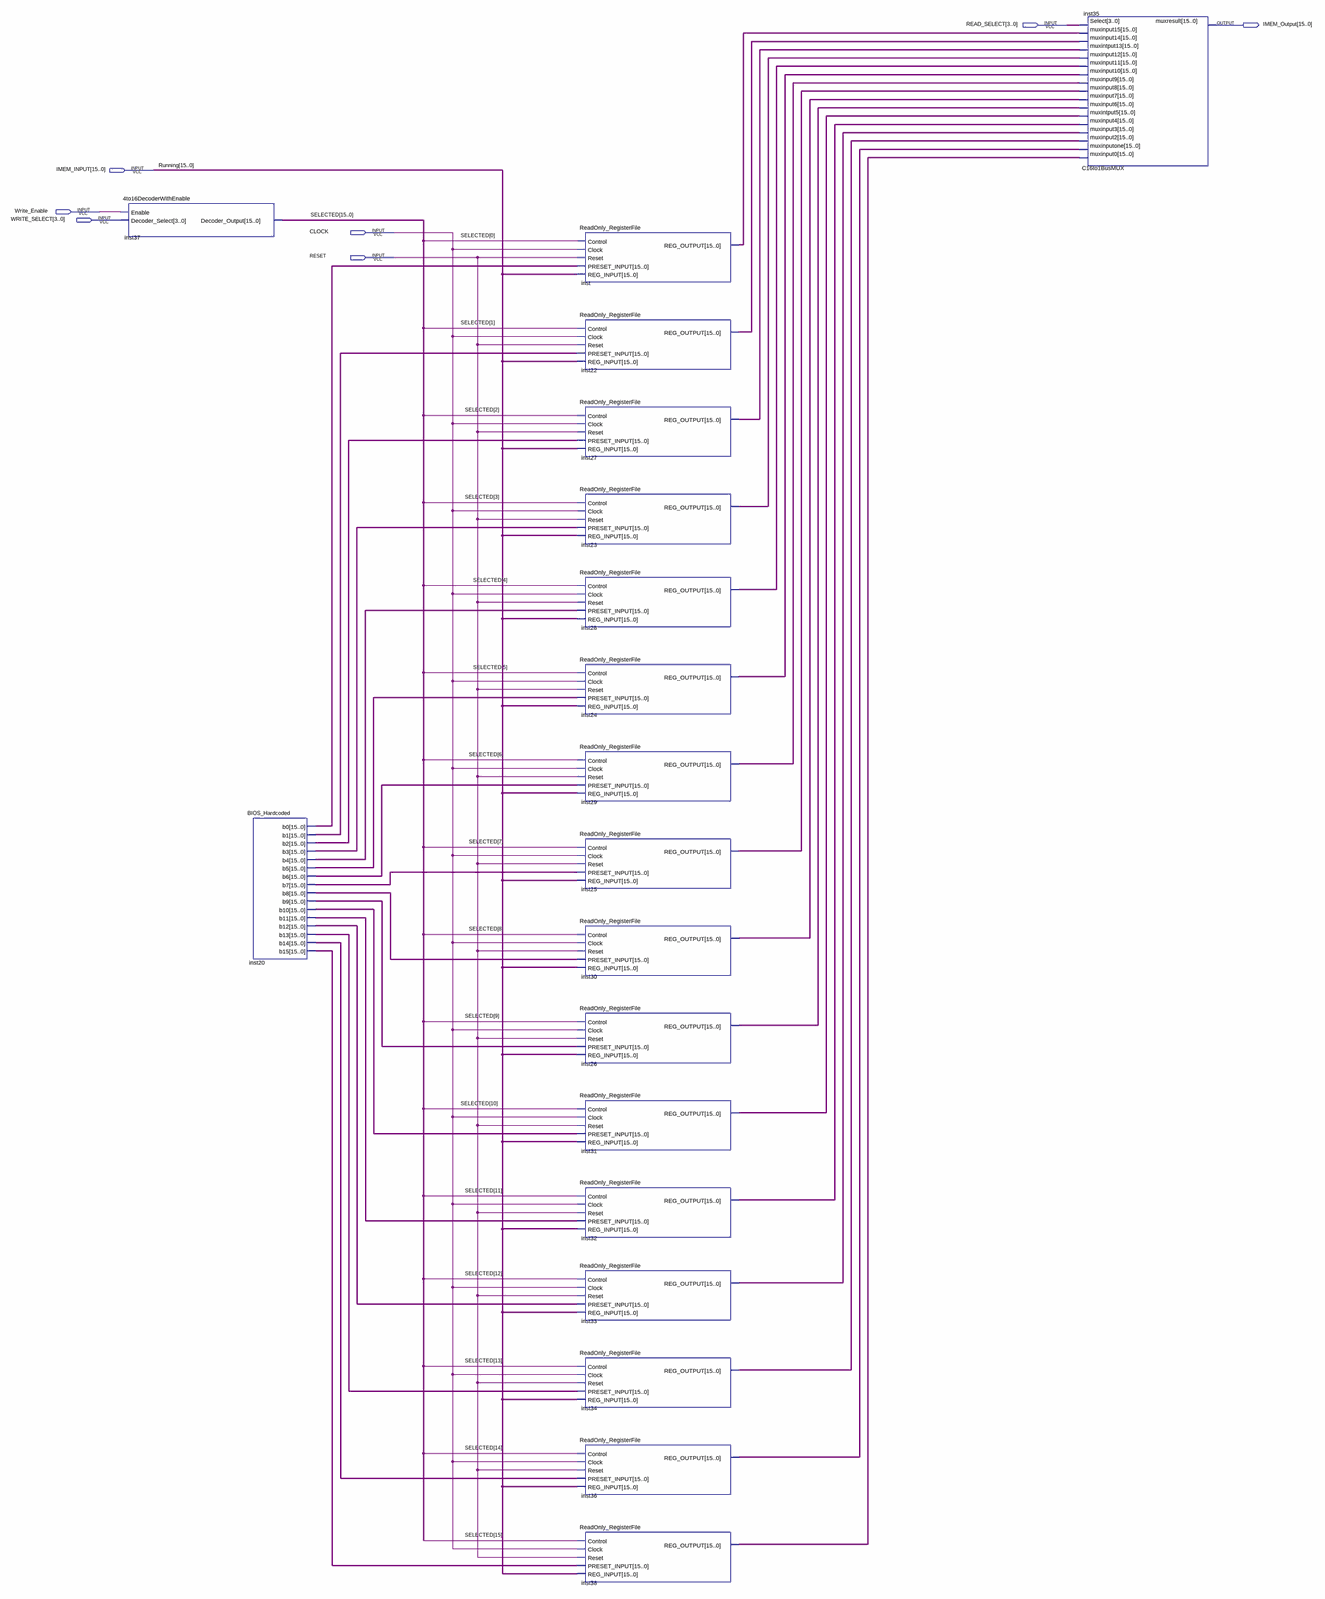
[diagram p0: schematic sheet, whole]
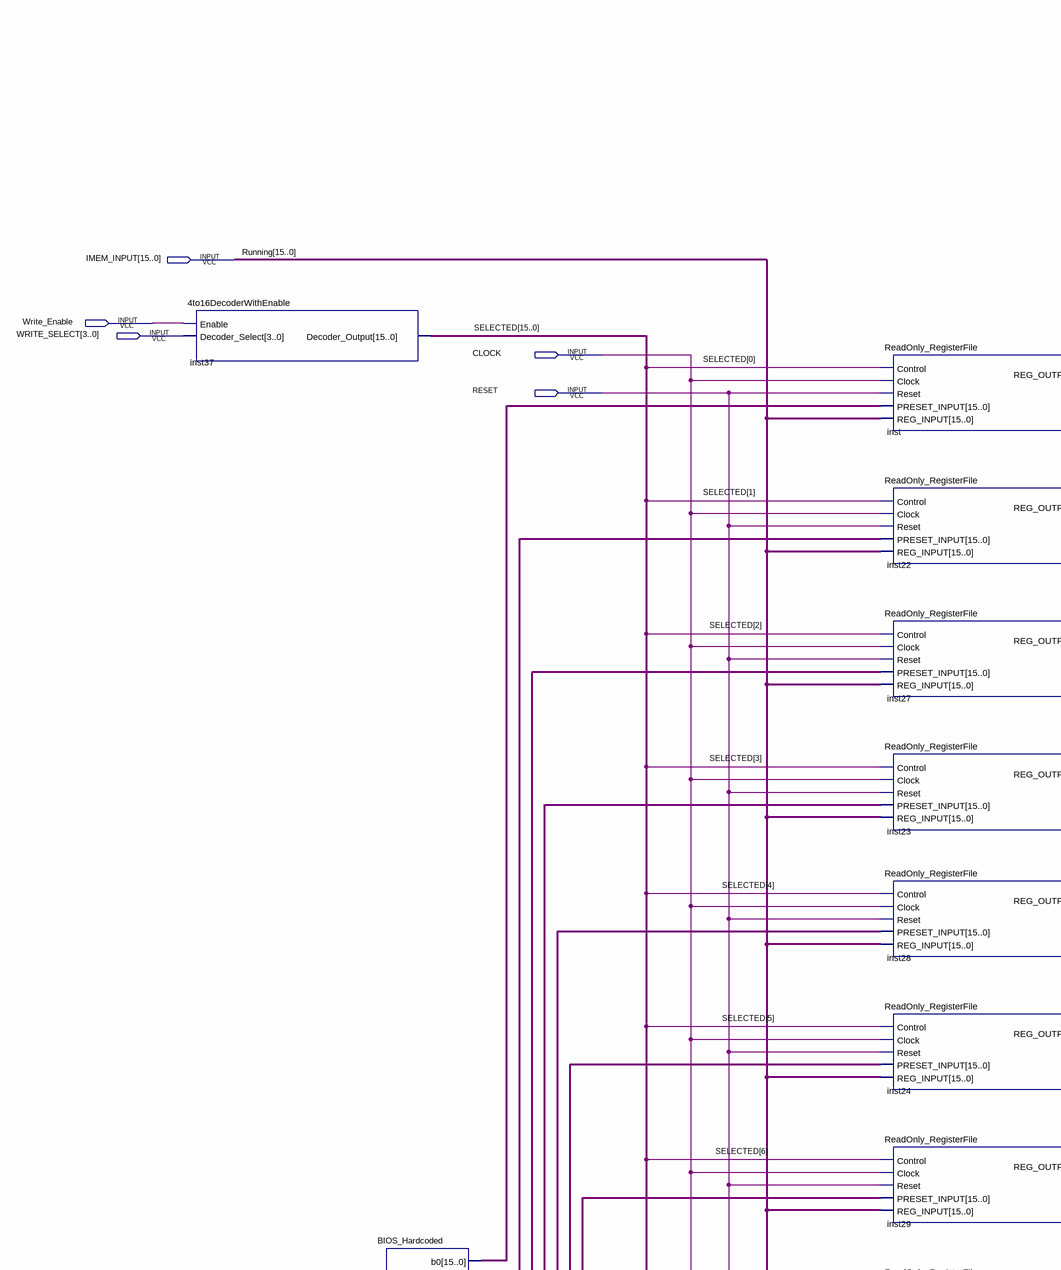
[diagram p1: schematic sheet, upper left part]
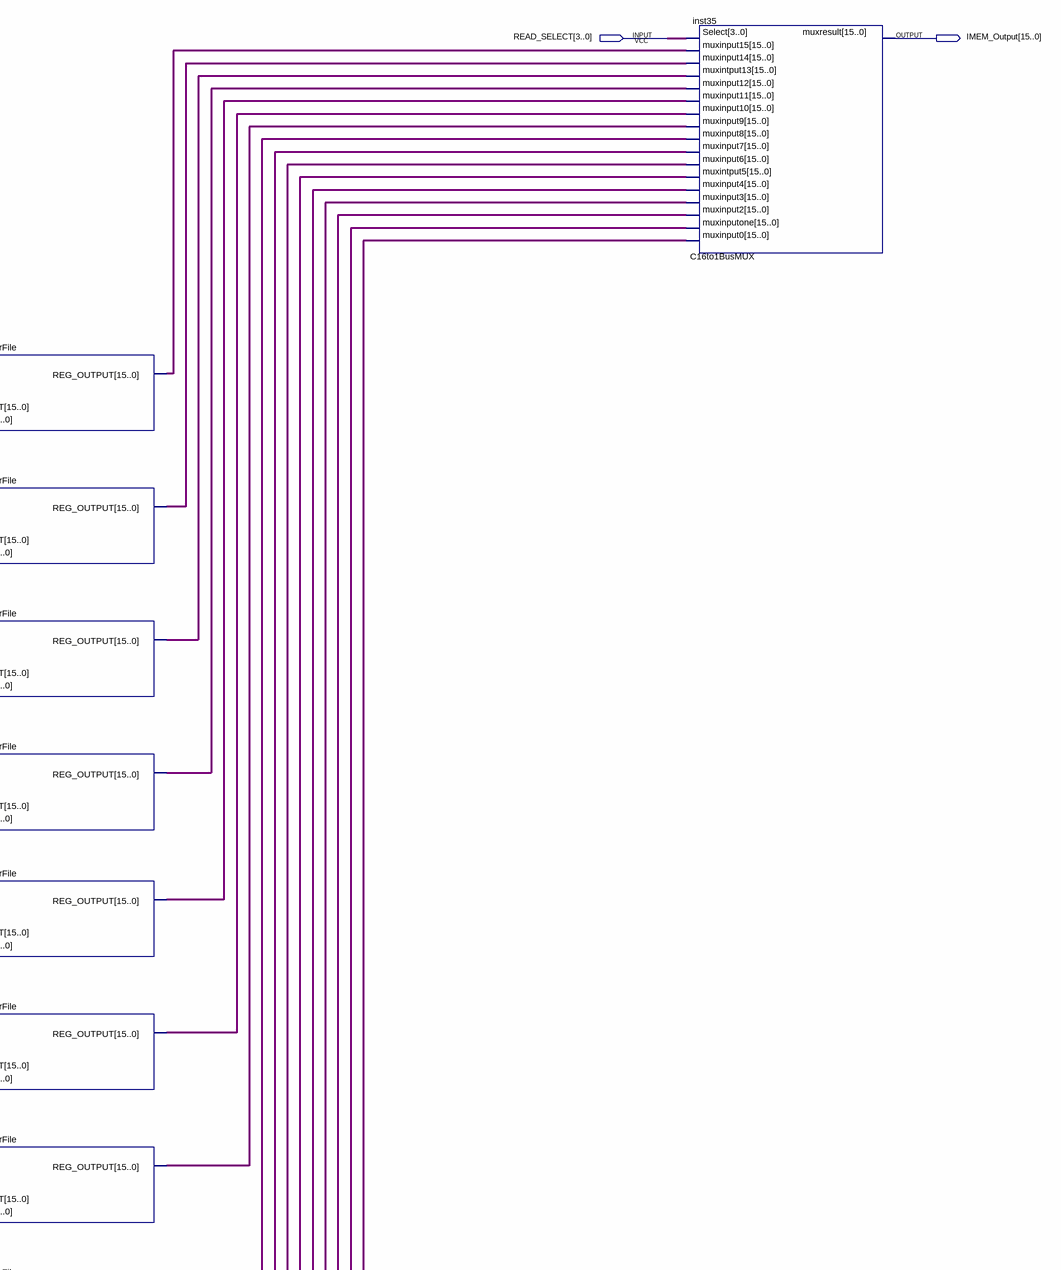
[diagram p2: schematic sheet, upper right part]
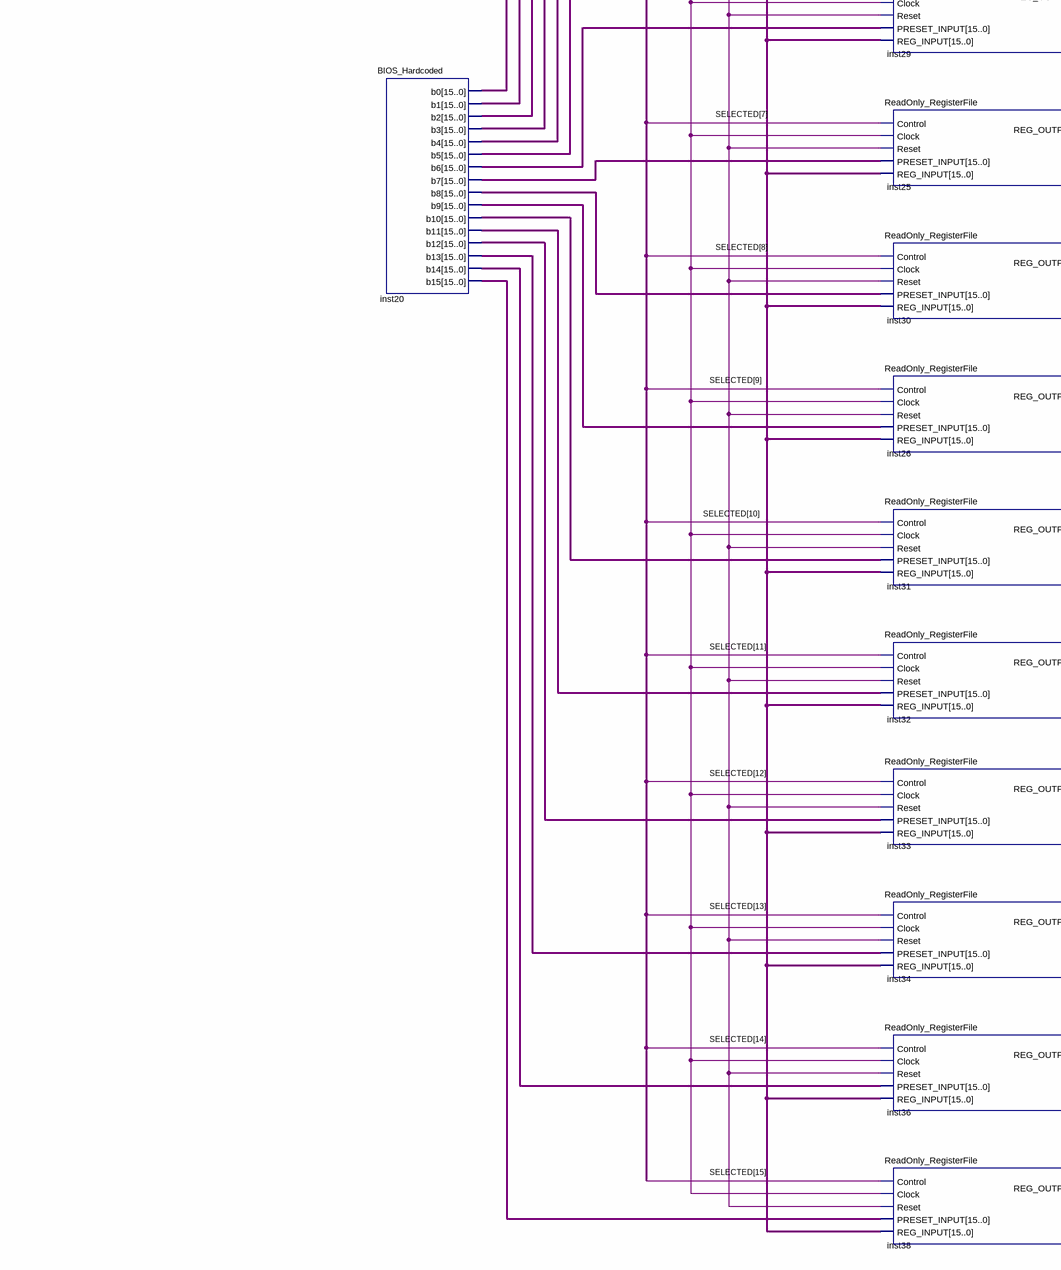
[diagram p3: schematic sheet, lower left part]
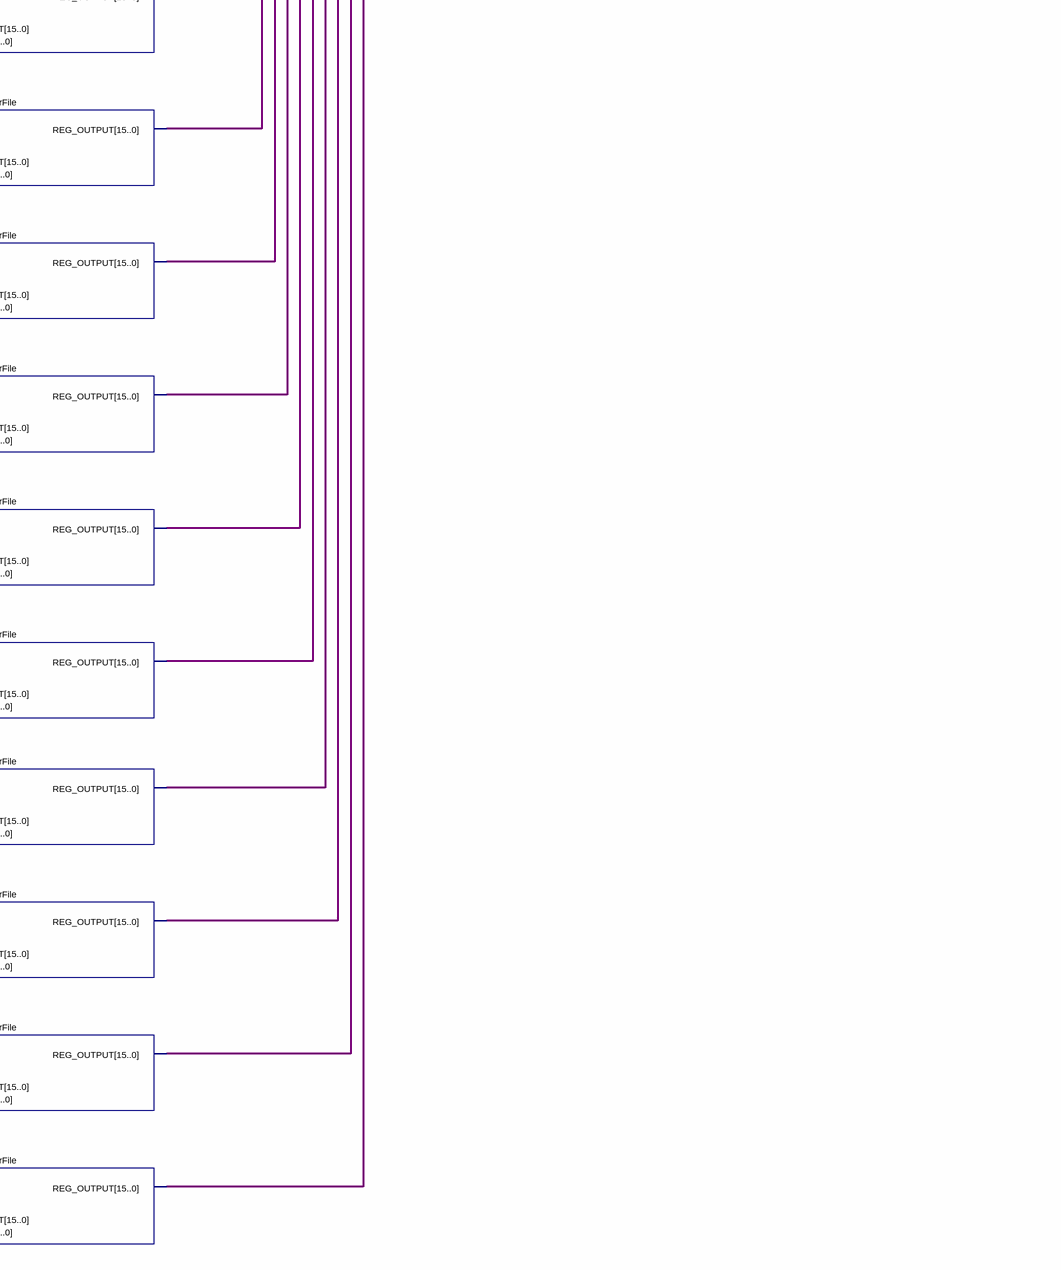
[diagram p4: schematic sheet, lower right part]
// Quartus schematic ReadOnly_16x16_Register_File.bdf as structural Verilog: 19 symbols, 7 pins
module ReadOnly_16x16_Register_File (
  input  [3:0] READ_SELECT,
  input  [15:0] IMEM_INPUT,
  input  Write_Enable,
  input  [3:0] WRITE_SELECT,
  input  CLOCK,
  input  RESET,
  output [15:0] IMEM_Output
);

  wire [15:0] inst20_b0, inst20_b1, inst20_b2, inst20_b3, inst20_b4, inst20_b5, inst20_b6, inst20_b7,
       inst20_b8, inst20_b9, inst20_b10, inst20_b11, inst20_b12, inst20_b13, inst20_b14, inst20_b15,
       inst22_reg_output, inst23_reg_output, inst24_reg_output, inst25_reg_output, inst26_reg_output,
       inst27_reg_output, inst28_reg_output, inst29_reg_output, inst30_reg_output, inst31_reg_output,
       inst32_reg_output, inst33_reg_output, inst34_reg_output, inst36_reg_output, inst38_reg_output,
       inst_reg_output, SELECTED;

  \4to16DecoderWithEnable  inst37 (.Enable(Write_Enable), .Decoder_Select(WRITE_SELECT), .Decoder_Output(SELECTED));
  BIOS_Hardcoded inst20 (
    .b0(inst20_b0), .b1(inst20_b1), .b2(inst20_b2), .b3(inst20_b3), .b4(inst20_b4), .b5(inst20_b5),
    .b6(inst20_b6), .b7(inst20_b7), .b8(inst20_b8), .b9(inst20_b9), .b10(inst20_b10), .b11(inst20_b11),
    .b12(inst20_b12), .b13(inst20_b13), .b14(inst20_b14), .b15(inst20_b15));
  ReadOnly_RegisterFile inst (
    .PRESET_INPUT(inst20_b0), .Control(SELECTED[0]), .Clock(CLOCK), .Reset(RESET), .REG_INPUT(IMEM_INPUT),
    .REG_OUTPUT(inst_reg_output));
  ReadOnly_RegisterFile inst22 (
    .PRESET_INPUT(inst20_b1), .Control(SELECTED[1]), .Clock(CLOCK), .Reset(RESET), .REG_INPUT(IMEM_INPUT),
    .REG_OUTPUT(inst22_reg_output));
  ReadOnly_RegisterFile inst27 (
    .PRESET_INPUT(inst20_b2), .Control(SELECTED[2]), .Clock(CLOCK), .Reset(RESET), .REG_INPUT(IMEM_INPUT),
    .REG_OUTPUT(inst27_reg_output));
  ReadOnly_RegisterFile inst23 (
    .PRESET_INPUT(inst20_b3), .Control(SELECTED[3]), .Clock(CLOCK), .Reset(RESET), .REG_INPUT(IMEM_INPUT),
    .REG_OUTPUT(inst23_reg_output));
  ReadOnly_RegisterFile inst28 (
    .PRESET_INPUT(inst20_b4), .Control(SELECTED[4]), .Clock(CLOCK), .Reset(RESET), .REG_INPUT(IMEM_INPUT),
    .REG_OUTPUT(inst28_reg_output));
  ReadOnly_RegisterFile inst24 (
    .PRESET_INPUT(inst20_b5), .Control(SELECTED[5]), .Clock(CLOCK), .Reset(RESET), .REG_INPUT(IMEM_INPUT),
    .REG_OUTPUT(inst24_reg_output));
  ReadOnly_RegisterFile inst29 (
    .PRESET_INPUT(inst20_b6), .Control(SELECTED[6]), .Clock(CLOCK), .Reset(RESET), .REG_INPUT(IMEM_INPUT),
    .REG_OUTPUT(inst29_reg_output));
  ReadOnly_RegisterFile inst25 (
    .PRESET_INPUT(inst20_b7), .Control(SELECTED[7]), .Clock(CLOCK), .Reset(RESET), .REG_INPUT(IMEM_INPUT),
    .REG_OUTPUT(inst25_reg_output));
  ReadOnly_RegisterFile inst30 (
    .PRESET_INPUT(inst20_b8), .Control(SELECTED[8]), .Clock(CLOCK), .Reset(RESET), .REG_INPUT(IMEM_INPUT),
    .REG_OUTPUT(inst30_reg_output));
  ReadOnly_RegisterFile inst26 (
    .PRESET_INPUT(inst20_b9), .Control(SELECTED[9]), .Clock(CLOCK), .Reset(RESET), .REG_INPUT(IMEM_INPUT),
    .REG_OUTPUT(inst26_reg_output));
  ReadOnly_RegisterFile inst31 (
    .PRESET_INPUT(inst20_b10), .Control(SELECTED[10]), .Clock(CLOCK), .Reset(RESET), .REG_INPUT(IMEM_INPUT),
    .REG_OUTPUT(inst31_reg_output));
  ReadOnly_RegisterFile inst32 (
    .PRESET_INPUT(inst20_b11), .Control(SELECTED[11]), .Clock(CLOCK), .Reset(RESET), .REG_INPUT(IMEM_INPUT),
    .REG_OUTPUT(inst32_reg_output));
  ReadOnly_RegisterFile inst33 (
    .PRESET_INPUT(inst20_b12), .Control(SELECTED[12]), .Clock(CLOCK), .Reset(RESET), .REG_INPUT(IMEM_INPUT),
    .REG_OUTPUT(inst33_reg_output));
  ReadOnly_RegisterFile inst34 (
    .PRESET_INPUT(inst20_b13), .Control(SELECTED[13]), .Clock(CLOCK), .Reset(RESET), .REG_INPUT(IMEM_INPUT),
    .REG_OUTPUT(inst34_reg_output));
  ReadOnly_RegisterFile inst36 (
    .PRESET_INPUT(inst20_b14), .Control(SELECTED[14]), .Clock(CLOCK), .Reset(RESET), .REG_INPUT(IMEM_INPUT),
    .REG_OUTPUT(inst36_reg_output));
  ReadOnly_RegisterFile inst38 (
    .PRESET_INPUT(inst20_b15), .Control(SELECTED[15]), .Clock(CLOCK), .Reset(RESET), .REG_INPUT(IMEM_INPUT),
    .REG_OUTPUT(inst38_reg_output));
  C16to1BusMUX inst35 (
    .muxinput0(inst38_reg_output), .muxinputone(inst36_reg_output), .muxinput2(inst34_reg_output),
    .muxinput3(inst33_reg_output), .muxinput4(inst32_reg_output), .muxintput5(inst31_reg_output),
    .muxinput6(inst26_reg_output), .muxinput7(inst30_reg_output), .muxinput8(inst25_reg_output),
    .muxinput9(inst29_reg_output), .muxinput10(inst24_reg_output), .muxinput11(inst28_reg_output),
    .muxinput12(inst23_reg_output), .muxintput13(inst27_reg_output), .muxinput14(inst22_reg_output),
    .muxinput15(inst_reg_output), .Select(READ_SELECT), .muxresult(IMEM_Output));

  // Other names for the same wires on the sheet: Running[15:0] = IMEM_INPUT
endmodule
